# EAGLE design parrot_v2 (EAGLE 9.4.1)
CNAME: Parrot Teensy Board; CREVISION: 1.0; DESIGNER: Nathan Villicana-Shaw
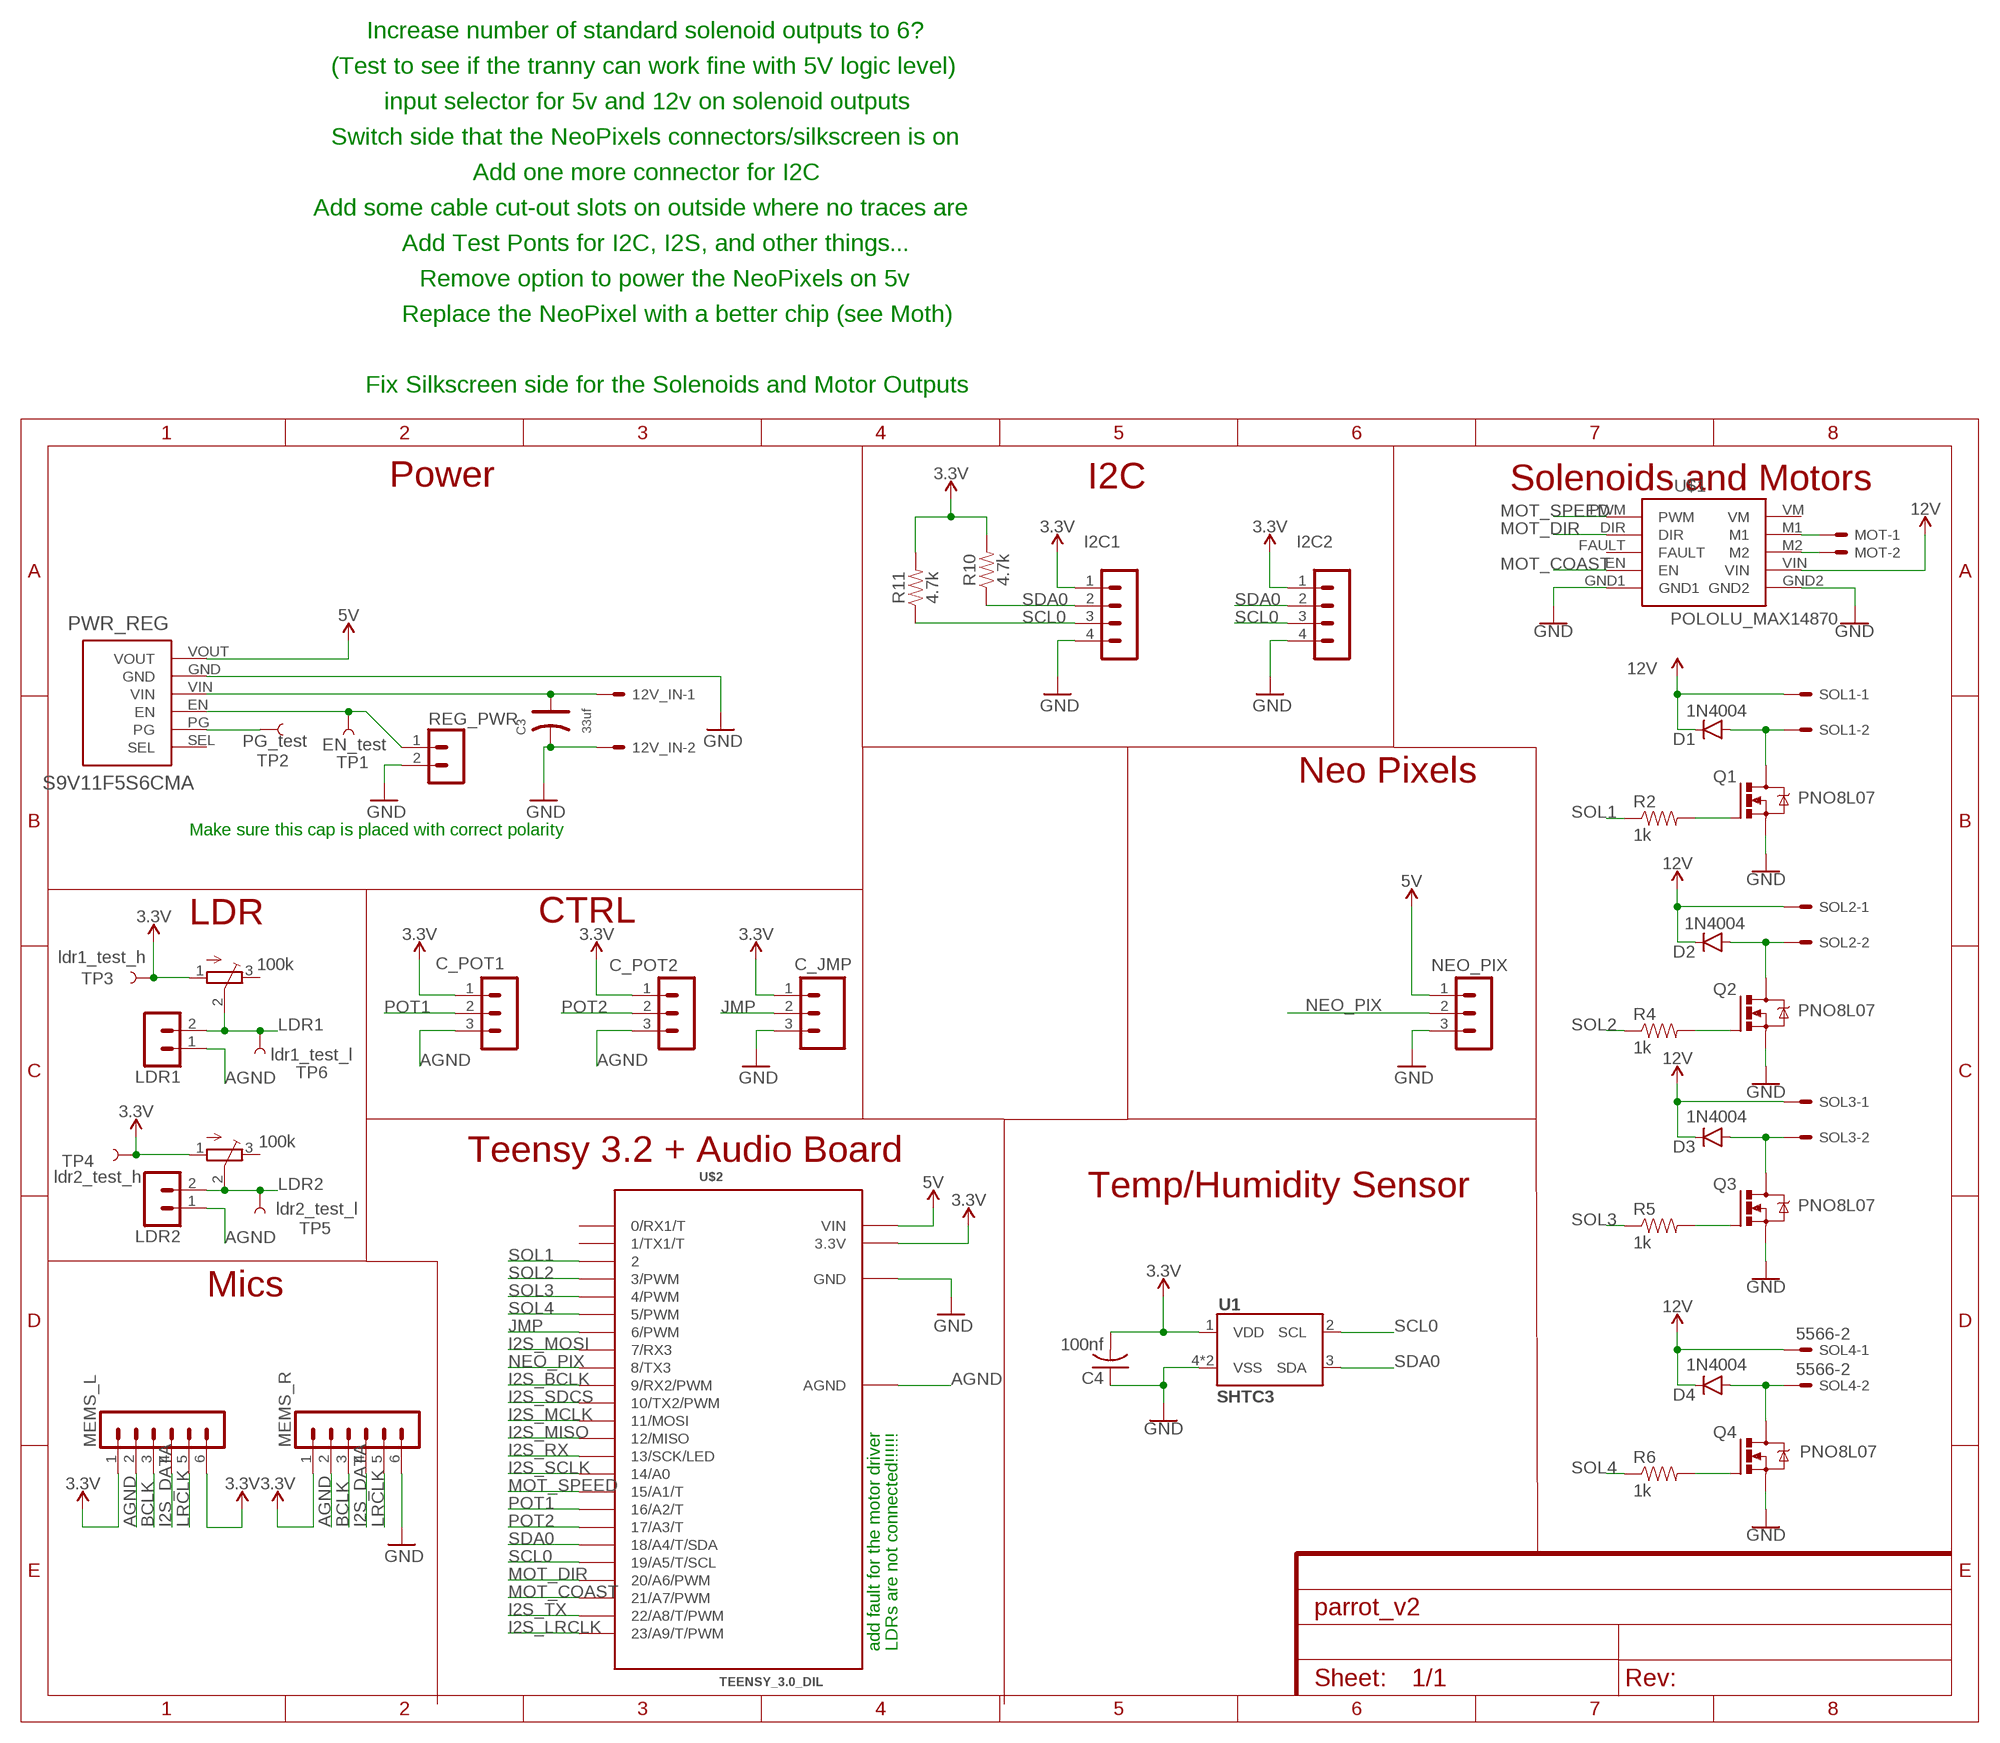
[diagram p0: schematic, sheet 1]

## Parts
12V_IN  5566-2  [5566-2]
C3  33uf  DIP-ALUMINUM-47UF-16V(D5-H7MM)  [PC-D5.3MM]
C4  100nf  C-USC2012  [C2012]
C_JMP  CONN_03  [1X03]
C_POT1  B3B-PH-K  [B3B-PH-K]
C_POT2  B3B-PH-K  [B3B-PH-K]
D1  1N4004  DIODEPTH  [DIODE-1N4001]
D2  1N4004  DIODEPTH  [DIODE-1N4001]
D3  1N4004  DIODEPTH  [DIODE-1N4001]
D4  1N4004  DIODEPTH  [DIODE-1N4001]
I2C1  B4B-PH-K  [B4B-PH-K]
I2C2  B4B-PH-K  [B4B-PH-K]
LDR1  B2B-PH-K  [B2B-PH-K]
LDR2  B2B-PH-K  [B2B-PH-K]
MEMS_L  B6B-PH-K  [B6B-PH-K]
MEMS_R  B6B-PH-K  [B6B-PH-K]
MOT  5566-2  [5566-2]
NEO_PIX  B3B-PH-K  [B3B-PH-K]
PWR_REG  S9V11F5S6CMA  [S9V11F3S5CMA]
Q1  PNO8L07  IRF540  [TO220BV]
Q2  PNO8L07  IRF540  [TO220BV]
Q3  PNO8L07  IRF540  [TO220BV]
Q4  PNO8L07  IRF540  [TO220BV]
R2  1k  10KOHM-HORIZ-1/4W-5%  [AXIAL-0.3]
R4  1k  10KOHM-HORIZ-1/4W-5%  [AXIAL-0.3]
R5  1k  10KOHM-HORIZ-1/4W-5%  [AXIAL-0.3]
R6  1k  10KOHM-HORIZ-1/4W-5%  [AXIAL-0.3]
R10  4.7k  10OHM-HORIZ-1/4W-1%  [AXIAL-0.3]
R11  4.7k  10OHM-HORIZ-1/4W-1%  [AXIAL-0.3]
REG_PWR  B2B-PH-K  [B2B-PH-K]
SOL1  5566-2  [5566-2]
SOL2  5566-2  [5566-2]
SOL3  5566-2  [5566-2]
SOL4  5566-2  [5566-2]
TM1  100k  TRIMPOTTC33X  [TC33X]
TM2  100k  TRIMPOTTC33X  [TC33X]
TP1  EN_test  TEST-POINTTP_15TH_THRU  [TP_15TH]
TP2  PG_test  TEST-POINTTP_15TH_THRU  [TP_15TH]
TP3  ldr1_test_h  TEST-POINTTP_15TH_THRU  [TP_15TH]
TP4  ldr2_test_h  TEST-POINTTP_15TH_THRU  [TP_15TH]
TP5  ldr2_test_l  TEST-POINTTP_15TH_THRU  [TP_15TH]
TP6  ldr1_test_l  TEST-POINTTP_15TH_THRU  [TP_15TH]
U1  SHTC3  [SHTC3]
U$1  POLOLU_MAX14870  [POLOLU_MAX14870]
U$2  TEENSY_3.0_DIL  [TEENSY_3.0-3.2&LC_DIL]

## Nets
3.3V [3.3V]: C4.2 C_JMP.1 C_POT1.1 C_POT2.1 I2C1.1 I2C2.1 MEMS_L.1 MEMS_L.6 MEMS_R.1 R10.P$2 R11.P$2 TM1.1(A) TM2.1(A) TP3.P$1 TP4.P$1 U1.1(VDD) U$2.3.3V
5V: NEO_PIX.1 PWR_REG.VOUT U$2.VIN
12V [12V_IN]: 12V_IN.1 C3.+ D1.C D2.C D3.C D4.C PWR_REG.VIN SOL1.1 SOL2.1 SOL3.1 SOL4.1 U$1.VIN
AGND: C_POT1.3 C_POT2.3 LDR1.1 LDR2.1 MEMS_L.2 MEMS_R.2 U$2.AGND
BCLK: MEMS_L.3 MEMS_R.3
GND: 12V_IN.2 C3.- C4.1 C_JMP.3 I2C1.4 I2C2.4 MEMS_R.6 NEO_PIX.3 PWR_REG.GND Q1.S Q2.S Q3.S Q4.S REG_PWR.2 U1.4(VSS) U1.5(VSS) U$1.GND2 U$2.GND
I2S_BCLK: U$2.9(9/RX2/PWM)
I2S_DATA: MEMS_L.4 MEMS_R.4
I2S_LRCLK: U$2.23/A9(23/A9/T/PWM)
I2S_MCLK: U$2.11(11/MOSI)
I2S_MISO: U$2.12(12/MISO)
I2S_MOSI: U$2.7(7/RX3)
I2S_RX: U$2.13(13/SCK/LED)
I2S_SCLK: U$2.14/A0
I2S_SDCS: U$2.10(10/TX2/PWM)
I2S_TX: U$2.22/A8(22/A8/T/PWM)
JMP: C_JMP.2 U$2.6(6/PWM)
LDR1: LDR1.2 TM1.2(S) TP6.P$1
LDR2: LDR2.2 TM2.2(S) TP5.P$1
LRCLK: MEMS_L.5 MEMS_R.5
MOT_COAST: U$1.EN U$2.21/A7(21/A7/PWM)
MOT_DIR: U$1.DIR U$2.20/A6(20/A6/PWM)
MOT_SPEED: U$1.PWM U$2.15/A1(15/A1/T)
N$3: PWR_REG.PG TP2.P$1
N$5: Q2.G R4.P$2
N$8: D2.A Q2.D SOL2.2
N$10: PWR_REG.EN REG_PWR.1 TP1.P$1
N$11: Q3.G R5.P$2
N$12: D3.A Q3.D SOL3.2
N$13: Q4.G R6.P$2
N$14: D4.A Q4.D SOL4.2
N$15: U$1.GND1 ; supply symbol labelled GND
N$24: Q1.G R2.P$2
N$25: D1.A Q1.D SOL1.2
N$30: MOT.2 U$1.M2
N$31: MOT.1 U$1.M1
NEO_PIX: NEO_PIX.2 U$2.8(8/TX3)
POT1: C_POT1.2 U$2.16/A2(16/A2/T)
POT2: C_POT2.2 U$2.17/A3(17/A3/T)
SCL0: I2C1.3 I2C2.3 R11.P$1 U1.2(SCL) U$2.19/A5(19/A5/T/SCL)
SDA0: I2C1.2 I2C2.2 R10.P$1 U1.3(SDA) U$2.18/A4(18/A4/T/SDA)
SOL1: R2.P$1 U$2.2
SOL2: R4.P$1 U$2.3(3/PWM)
SOL3: R5.P$1 U$2.4(4/PWM)
SOL4: R6.P$1 U$2.5(5/PWM)
Unconnected: PWR_REG.SEL TM1.3(E) TM2.3(E) U$1.FAULT U$1.VM U$2.0(0/RX1/T) U$2.1(1/TX1/T)

## Notes on the sheet
- Increase number of standard solenoid outputs to 6?
- (Test to see if the tranny can work fine with 5V logic level)
- input selector for 5v and 12v on solenoid outputs
- Switch side that the NeoPixels connectors/silkscreen is on
- Add one more connector for I2C
- Add some cable cut-out slots on outside where no traces are
- Add Test Ponts for I2C, I2S, and other things...
- Remove option to power the NeoPixels on 5v
- Replace the NeoPixel with a better chip (see Moth)
- Fix Silkscreen side for the Solenoids and Motor Outputs
- Solenoids and Motors
- Power | I2C
- Neo Pixels
- Make sure this cap is placed with correct polarity
- LDR | CTRL
- Teensy 3.2 + Audio Board
- Temp/Humidity Sensor
- Mics
- add fault for the motor driver | LDRs are not connected!!!!!!

## Library data of the parts
12V_IN MOT SOL1-SOL4 = con-molex:5566-2: Mini FIT connector 2 pol Source: http://www.molex.com; MF: MOLEX; OC_FARNELL: 1822072; OC_NEWARK: unknown
C3 = Seeed-Capacitor:DIP-ALUMINUM-47UF-16V(D5-H7MM): 302030033; MPN: KS 100uF/16V; VALUE: 100uf
C4 = adafruit:C-US: CAPACITOR, American symbol
C_JMP = SparkFun-Connectors:CONN_03: Multi connection point. Often used as Generic Header-pin footprint for 0.1 inch spaced/style header connections On any of the 0.1 inch spaced packages, you can populate with these: Break Away Headers - Straight <https://www.sparkfun.com/products/116> (PRT-00116) Break Away Male Headers - Right Angle <https://www.sparkfun.com/products/553> (PRT-00553) Female Headers <https://www.sparkfun.com/products/115> (PRT-00115) Break Away Headers - Machine Pin <https://www.sparkfun.com/products/117> (PRT-00117) Break Away Female Headers - Swiss Machine Pin <https://www.sparkfun.com/products/743> (PRT-00743) Stackable Header - 3 Pin (Female, 0.1") <https://www.sparkfun.com/products/13875> (PRT-13875) For SCREWTERMINALS and SPRING TERMINALS visit here: Screw Terimnals on SparkFun.com <https://www.sparkfun.com/search/results?term=Screw+Terminals> (5mm/3.5mm/2.54mm spacing) This device is also useful as a general connection point to wire up your design to another part of your project. Our various solder wires solder well into these plated through hole pads. Hook-Up Wire - Assortment (Stranded, 22 AWG) <https://www.sparkfun.com/products/11375> (PRT-11375) Hook-Up Wire - Assortment (Solid Core, 22 AWG) <https://www.sparkfun.com/products/11367> (PRT-11367) View the entire wire category on our website here <https://www.sparkfun.com/categories/141> Special notes: Molex polarized connector foot print use with SKU : PRT-08232 with associated crimp pins and housings.
C_POT1 C_POT2 NEO_PIX = con-jst-ph:B3B-PH-K: HEADER
D1-D4 = SparkFun-DiscreteSemi:DIODE: Diode These are standard reverse protection diodes and small signal diodes. SMA package can handle up to about 1A. SOD-323 can handle about 200mA. What the SOD-323 package when ordering, there are some mfgs out there that are 5-pin packages.
I2C1 I2C2 = con-jst-ph:B4B-PH-K: HEADER
LDR1 LDR2 REG_PWR = con-jst-ph:B2B-PH-K: HEADER
MEMS_L MEMS_R = con-jst-ph:B6B-PH-K: HEADER
PWR_REG = nathans-custom-parts:S9V11F5S6CMA
Q1-Q4 = transistor-power:IRF540: HEXFET Power MOSFET
R2 R4-R6 = SparkFun-Resistors:10KOHM: 10kΩ resistor A resistor is a passive two-terminal electrical component that implements electrical resistance as a circuit element. Resistors act to reduce current flow, and, at the same time, act to lower voltage levels within circuits. - Wikipedia; PROD_ID: RES-09435; VALUE: 10k
R10 R11 = SparkFun-Resistors:10OHM: 10Ω resistor A resistor is a passive two-terminal electrical component that implements electrical resistance as a circuit element. Resistors act to reduce current flow, and, at the same time, act to lower voltage levels within circuits. - Wikipedia; PROD_ID: RES-12180; VALUE: 10
TM1 TM2 = adafruit:TRIMPOT: SMT trimmer potentiometer part number TC33X http://www.ladyada.net/library/eagle
TP1-TP6 = SparkFun-Connectors:TEST-POINT: SparkFun Test Points Bare copper test points for troubleshooting or In-Circuit-Testing. These are used by our Production team for verifying production board runs using pogo-pins on test beds. SparkFun Products: SparkFun LSM9DS1 Breakout <https://www.sparkfun.com/products/13284> SparkFun PSOC <https://www.sparkfun.com/products/13714> SparkFun Load Cell Amplifier <https://www.sparkfun.com/products/13879>
U1 = SHTC3:SHTC3
U$1 = nathans-custom-parts:POLOLU_MAX14870
U$2 = teensy_3_and_LC:TEENSY_3.0_DIL: TEENSY 3.0 in a classic breadboard layout - pins between the two outer rows.

## Net classes
0 default: width 0.152 mm, drill 0.508 mm, clearance 0.203 mm
1 12V_IN: width 1.27 mm, drill 0.762 mm, clearance 0.305 mm
2 3.3V: width 0.203 mm, drill 0.508 mm, clearance 0.254 mm
3 5V: width 0.406 mm, drill 0.508 mm, clearance 0.381 mm

## Board
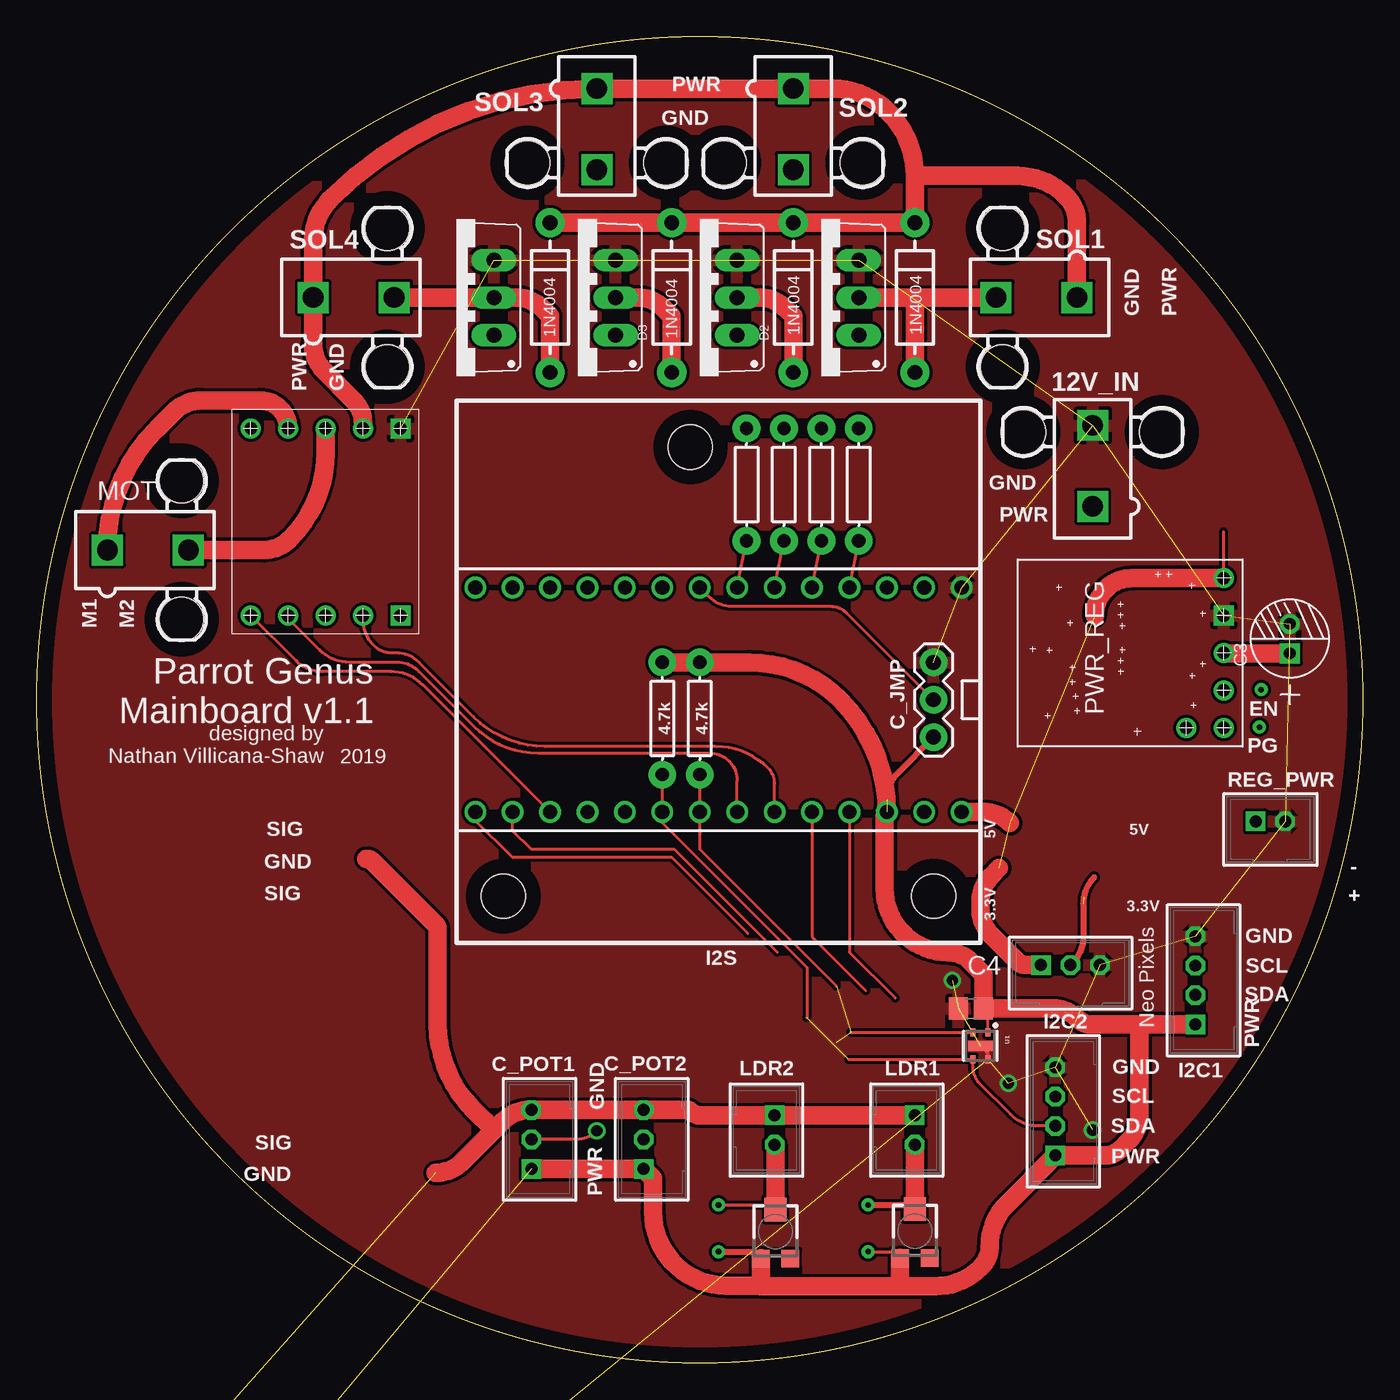
[diagram p1: board, top side]
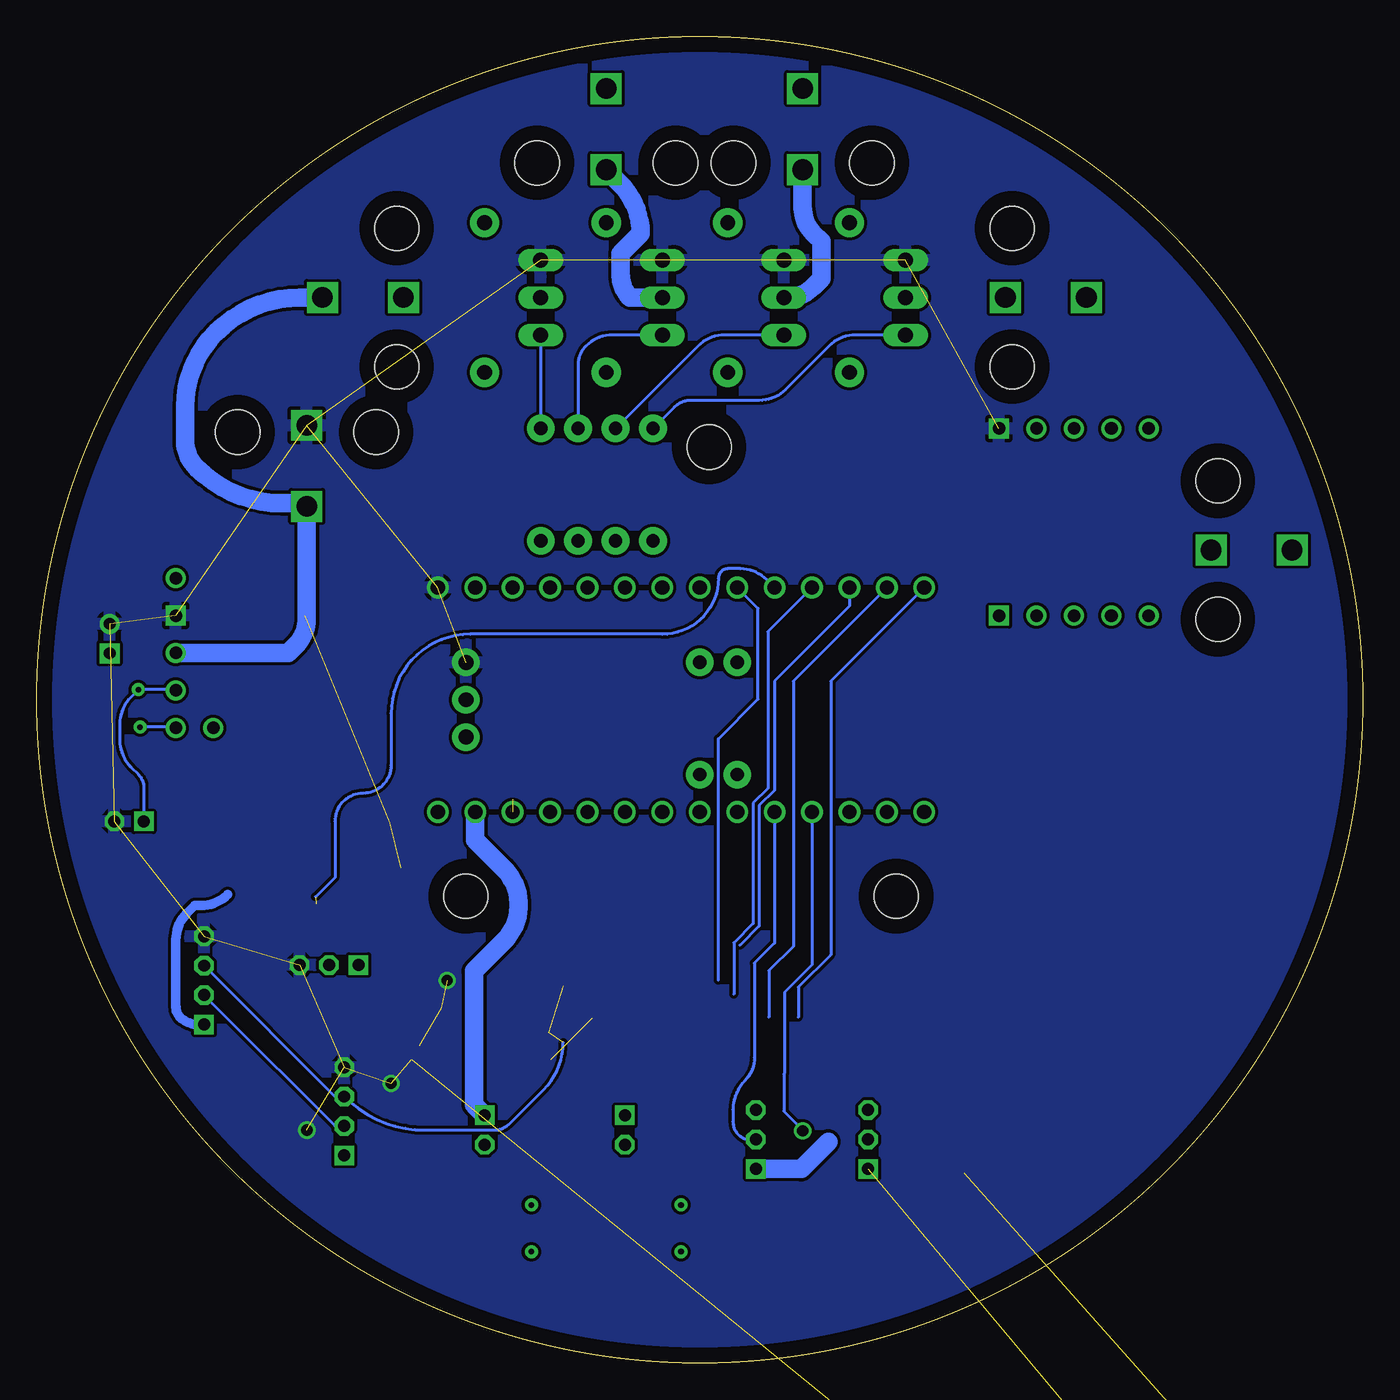
[diagram p2: board, bottom side, seen from below]

Size 90 x 90 mm. Coordinates in mm from the lower left corner, seen from the top.
Outline: circle at 45,45 radius 45
Copper layers (1*16): Top 0.035mm / dielectric 1.5mm / Bottom 0.035mm
Design rules "PCBway": minimum track width 6mil, minimum drill 0.3mm, track to track 0.205mm, track to pad 0.205mm, pad to pad 0.205mm, via to via 0.205mm, smd to smd 8mil, copper to edge 40mil, drill to drill 8mil, minimum pad ring 10mil, minimum via ring 8mil, stop-mask expansion 4mil, vias tented up to drill 25mil, thermal gap 10mil
Holes 3 mm at 44.37,62.15 31.66,31.67 60.88,31.67

### Footprints (pad centres in the part's own frame; a part is rotated, then mirrored left to right if it is on the bottom)
5566-2 = drill 1.4 square: 1 0,-2.75; 2 0,2.75 | hole 3: 4.7,2.29; -4.7,2.29
PC-D5.3MM = drill 0.8 pad 1.35 square: + -1,0 | drill 0.8 pad 1.35: - 1,0
C2012 = smd 1.3 x 1.5: 1 -0.85,0; 2 0.85,0
1X03 = drill 1.016 pad 1.88: 1 0,0; 2 2.54,0; 3 5.08,0
B3B-PH-K = drill 0.813 square: 1 -2,0 | drill 0.813 octagon: 2 0,0; 3 2,0
DIODE-1N4001 = drill 1 pad 1.981: A -5.08,0; C 5.08,0
B4B-PH-K = drill 0.813 square: 1 -3,0 | drill 0.813 octagon: 2 -1,0; 3 1,0; 4 3,0
B2B-PH-K = drill 0.813 square: 1 -1,0 | drill 0.813 octagon: 2 1,0
B6B-PH-K = drill 0.813 square: 1 -5,0 | drill 0.813 octagon: 2 -3,0; 3 -1,0; 4 1,0; 5 3,0; 6 5,0
S9V11F3S5CMA = drill 0.85: EN 3.81,1.27; PG 1.27,1.27; SEL 1.27,3.81; VIN 6.35,1.27; VOUT 11.43,1.27 | drill 0.85 square: GND 8.89,1.27
TO220BV = drill 1.016 long: D 0,-2.54; G -2.54,-2.54; S 2.54,-2.54
AXIAL-0.3 = drill 0.9 pad 1.88: P$1 -3.81,0; P$2 3.81,0
TC33X = smd 1.2 x 1.2: 1 -1,-1.825; 3 1,-1.825 | smd 1.5 x 1.6: 2 0,1.5
TP_15TH = drill 0.381 pad 0.61: P$1 0,0
SHTC3 = smd 0.55 x 0.35: 1 -0.925,0.5; 2 -0.925,-0.5; 3 0.925,-0.5; 4 0.925,0.5 | smd 0.7 x 1.6: 5 0,0
POLOLU_MAX14870 = drill 0.85: DIR 1.27,8.89; EN 1.27,3.81; FAULT 1.27,6.35; M1 13.97,8.89; M2 13.97,6.35; PWM 1.27,11.43; VIN 13.97,3.81; VM 13.97,11.43 | drill 0.85 square: GND1 1.27,1.27; GND2 13.97,1.27
TEENSY_3.0-3.2&LC_DIL = drill 0.965: 0 -7.62,13.97; 1 -7.62,11.43; 2 -7.62,8.89; 3 -7.62,6.35; 3.3V 7.62,11.43; 4 -7.62,3.81; 5 -7.62,1.27; 6 -7.62,-1.27; 7 -7.62,-3.81; 8 -7.62,-6.35; 9 -7.62,-8.89; 10 -7.62,-11.43; 11 -7.62,-13.97; 12 -7.62,-16.51; 13 7.62,-16.51; 14/A0 7.62,-13.97; 15/A1 7.62,-11.43; 16/A2 7.62,-8.89; 17/A3 7.62,-6.35; 18/A4 7.62,-3.81; 19/A5 7.62,-1.27; 20/A6 7.62,1.27; 21/A7 7.62,3.81; 22/A8 7.62,6.35; 23/A9 7.62,8.89; AGND 7.62,13.97; GND -7.62,16.51; VIN 7.62,16.51

### Placement (x,y rotation side)
12V_IN  71.67,60.88 0 top
C3  85.06,49.15 90 top
C4  63.42,24.05 0 top
C_JMP  60.88,42.46 90 top
C_POT1  33.57,15.16 90 top
C_POT2  41.19,15.16 90 top
D1  59.61,72.31 90 top
D2  51.35,72.31 90 top
D3  43.09,72.31 90 top
D4  34.84,72.31 90 top
I2C1  78.66,25.95 90 top
I2C2  69.13,17.06 90 top
LDR1  59.61,15.79 270 top
LDR2  50.08,15.79 270 top
MEMS_L  -0.09,-21.04 0 top  (outside the outline)
MEMS_R  -0.09,-28.02 0 top  (outside the outline)
MOT  7.54,55.16 270 top
NEO_PIX  70.17,27 0 top
PWR_REG  81.83,41.83 90 top
Q1  53.26,72.31 90 top
Q2  45,72.31 90 top
Q3  36.75,72.31 90 top
Q4  28.49,72.31 90 top
R2  55.8,59.61 90 top
R4  53.26,59.61 90 top
R5  50.72,59.61 90 top
R6  48.18,59.61 90 top
R10  42.46,43.73 90 top
R11  45,43.73 90 top
REG_PWR  83.73,36.75 0 top
SOL1  67.86,72.31 90 top
SOL2  51.35,83.73 180 top
SOL3  38.02,83.73 180 top
SOL4  21.51,72.31 270 top
TM1  59.61,8.93 0 top
TM2  50.14,8.9 0 top
TP1  83.11,45.68 0 top
TP2  82.99,43.14 0 top
TP3  46.27,7.54 0 top
TP4  56.43,7.54 0 top
TP5  46.27,10.71 0 top
TP6  56.43,10.71 0 top
U1  64.05,21.51 270 top
U$1  25.95,49.45 90 top
U$2  46.27,45 270 top

### Tracks (layer width: path | path; a pad name or v marks a point on that pad's centre or on a via)
3.3V  (4 unrouted)
  Top 0.203: U1.1 64.55,23.76 | TP4.P$1 58.18,7.54 arc-90 TM1.1
  Top 0.406: 64.55,23.76 C4.2 | TP3.P$1 48.68,7.54 TM2.1 | C_JMP.1 58.44,40.03 arc45 57.7,38.23
  Top 1.27: R11.P$2 R10.P$2 48.35,47.54 arc-45 54.56,44.97 arc-45 U$2.3.3V arc45 57.54,36.99 57.54,32.2 arc90 61.88,27.86 arc-45 63.42,27.22 64.27,26.37 C4.2 68.98,24.05 arc-45 70.6,23.38 arc45 71.63,22.95 74.84,22.95 | I2C1.1 74.84,22.95 | 74.84,22.95 74.84,16.84 arc-45 74.1,15.05 73.58,14.52 arc-45 72.46,14.06 I2C2.1 65.87,10.8 arc45 64.69,7.94 arc-45 64.08,6.48 arc-45 60.96,5.19 58.97,5.19 | C_POT1.1 C_POT2.1 41.83,12.52 41.83,10.23 arc90 46.82,5.23 49.27,5.23 arc-45 49.16,5.19 | 49.16,5.19 58.97,5.19 | TM2.1 49.14,5.19 49.16,5.19 | 58.61,5.55 58.97,5.19 | TM1.1 58.61,5.55 | 58.61,5.55 arc90 58.97,5.19
  Bottom 0.635: 77.06,31.77 arc45 78.85,31.03 79.29,31.03 79.82,30.5 arc-45 80.56,28.71 80.56,24.17 arc-45 80.26,23.45 arc-45 79.06,22.95 I2C1.1
  Bottom 1.27: C_POT2.1 38.11,13.16 36.27,15
5V  (2 unrouted)
  Top 0.203: PWR_REG.VOUT 80.56,56.4
  Top 1.27: 71.81,50.72 arc-90 74.34,53.26 PWR_REG.VOUT | U$2.VIN 64.27,37.38 arc-45 66.06,36.64 | 65.32,33.57 64.79,33.04 arc45 64.05,31.25 64.05,30.81 arc45 64.79,29.02 66.59,27.22 arc45 67.13,27 NEO_PIX.1
12V
  Top 1.27: D3.C D1.C 59.61,80.56 | 59.61,80.56 arc45 57.81,84.9 arc45 53.97,86.48 SOL2.1 SOL3.1 arc45 19.95,79 arc45 18.76,76.13 SOL4.1 18.76,69.12 arc45 19.5,67.33 21.51,65.32 arc-45 22.14,63.79 U$1.VIN | SOL1.1 70.61,77.39 arc45 69.87,79.19 arc45 66.56,80.56 59.61,80.56 | PWR_REG.VIN arc-45 80.62,48.15 C3.+ | D3.C D4.C | D2.C D3.C
  Bottom 1.27: PWR_REG.VIN 72.94,48.18 72.41,48.7 arc-45 71.67,50.5 12V_IN.1 arc-45 72.18,58.34 73.31,58.34 arc45 79.18,60.77 arc45 79.93,62.56 79.93,64.93 arc45 77.86,69.93 arc45 72.12,72.31 SOL1.1
AGND  (2 unrouted)
  Top 1.27: 27.07,12.89 arc45 28.87,13.63 31.03,15.79 | 31.03,15.79 31.65,16.41 arc-45 33.45,17.16 C_POT1.3 C_POT2.3 44.14,17.16 arc-45 44.37,17.06 arc45 45.02,16.79 LDR2.1 LDR1.1 | 22.36,34.21 arc-45 22.8,34.02 27.14,29.68 arc-23 27.22,29.28 27.22,22.93 arc45 29.57,17.25 31.03,15.79
  Bottom 1.27: LDR1.1 60.33,17.51 60.33,26.58 58.31,28.6 arc-90 58.31,33.56 60.24,35.49 U$2.AGND
BCLK  (1 unrouted)
GND  (via drill 0.76)  (19 unrouted)
  Top 0.203: U1.4 64.55,20.87 | 64.55,20.87 64.55,21.18 arc-45 64.69,21.51 | U1.5 64.45,21.1 arc-45 64.55,20.87
  other vias: 62.15,25.95 65.95,18.97 71.67,15.79
  pour Top: -7.07,89.45 -7.07,-1.35 102.78,-1.35 102.78,89.45
  pour Bottom: -7.07,90.72 104.69,90.72 104.69,-2.62 -7.07,-2.62
I2S_BCLK
  Bottom 0.203: U$2.9 40.37,49.63 40.37,38.98 41.37,37.98 41.37,29.81 42.68,28.5 42.68,25
I2S_DATA  (1 unrouted)
I2S_LRCLK
  Top 0.203: U$2.23/A9 55.16,27.86 58.27,24.75
I2S_MCLK
  Bottom 0.203: U$2.11 38.65,46.27 38.65,28.27 40.3,26.62 40.3,23.44
I2S_MISO
  Bottom 0.203: U$2.12 36.11,46.27 36.11,27.7 38.3,25.51 38.3,23.44
I2S_MOSI
  Bottom 0.203: U$2.7 41.04,51.2 41.04,45.05 43.73,42.35 43.73,25.95
I2S_RX
  Top 0.203: 48.27,29.13 43.11,34.28 32.3,34.28 29.76,36.82 U$2.13
I2S_SCLK
  Top 0.203: 50.27,27.86 43.29,34.84 33.57,34.84 32.3,36.11 U$2.14/A0
I2S_SDCS
  Bottom 0.203: U$2.10 34.84,51.35 39.92,46.27 39.92,38.86 40.96,37.81 40.96,29.64 42.27,28.33
I2S_TX
  Top 0.203: U$2.22/A8 52.62,28.9 56.27,25.25
JMP
  Top 0.203: U$2.6 45.63,51.98 arc45 47.17,51.35 53.89,51.35 arc-45 54.97,50.9 C_JMP.2
LDR1
  Top 0.406: TP6.P$1 59.33,10.71 TM1.2
  Top 1.27: LDR1.2 TM1.2
LDR2
  Top 0.203: TP5.P$1 49.83,10.71 TM2.2
  Top 1.27: LDR2.2 arc-45 50.14,14.64 TM2.2
LRCLK  (1 unrouted)
MOT_COAST
  Top 0.203: U$2.21/A7 50.08,39.29 arc45 49.63,40.37 arc45 46.12,41.83 34.51,41.83 arc-45 29.65,43.84 25.95,47.54 arc45 24.42,48.18 24.05,48.18 arc-45 22.96,48.62 22.78,48.81 arc-45 22.14,50.34 U$1.EN
MOT_DIR
  Top 0.203: U$2.20/A6 47.54,39.5 arc90 45.66,41.38 34.05,41.38 arc-45 29.65,43.2 25.94,46.92 arc45 24.43,47.54 21.23,47.54 arc-45 19.21,48.38 17.06,50.52 U$1.DIR
MOT_SPEED
  Top 0.203: U$2.15/A1 26.21,46.01 arc45 24.04,46.91 19.38,46.91 arc-45 17.59,47.65 U$1.PWM
N$3
  Bottom 0.203: PWR_REG.PG arc-45 80.68,43.15 TP2.P$1
N$5
  Bottom 0.203: Q2.G 50.93,69.77 arc-45 52.73,69.02 arc-45 53.26,67.75 R4.P$2
N$8
  Top 1.27: Q2.D 49.03,72.31 arc-45 50.82,71.56 51.35,71.04 D2.A
  Bottom 1.27: SOL2.2 50.43,80.06 arc45 49.01,76.64 50.37,75.29 50.37,73.84 arc-45 49.73,72.31 Q2.D
N$10
  Bottom 0.203: PWR_REG.EN arc-45 80.68,45.69 TP1.P$1 83.63,45.17 arc-45 84.37,43.37 84.37,42.24 arc-45 83.63,40.45 83.1,39.92 arc45 82.73,39.04 REG_PWR.1
N$11
  Bottom 0.203: Q3.G 43.31,69.77 arc-45 45.11,69.02 R5.P$2
N$12
  Top 1.27: Q3.D 40.77,72.31 arc-45 42.57,71.56 43.09,71.04 D3.A
  Bottom 1.27: SOL3.2 38.02,78.44 arc-45 37.27,76.64 36.75,76.12 36.75,73.58 37.27,73.05 arc45 39.07,72.31 Q3.D
N$13
  Bottom 0.203: Q4.G 34.42,69.77 arc-45 36.22,69.02 39.18,66.06 arc45 40.97,65.32 45.63,65.32 arc-45 46.72,64.87 R6.P$2
N$14
  Top 1.27: SOL4.2 Q4.D 32.52,72.31 arc-45 34.31,71.56 34.84,71.04 D4.A
N$24
  Bottom 0.203: Q1.G R2.P$2
N$25
  Top 1.27: Q1.D 59.61,72.31 | 59.61,72.31 SOL1.2 | D1.A 59.61,72.31
N$30
  Top 1.27: U$1.M2 19.6,61.77 arc-45 17.17,55.9 arc-45 15.37,55.16 MOT.2
N$31
  Top 1.27: MOT.1 4.79,55.29 arc-45 8.14,63.38 9.33,64.58 arc-45 11.13,65.32 15.16,65.32 arc-90 U$1.M1
NEO_PIX  (1 unrouted)
  Top 0.406: 71.78,32.94 arc45 71.03,31.15 71.03,28.91 arc-45 70.29,27.12 NEO_PIX.2
  Bottom 0.203: U$2.8 40.45,53.15 arc-45 42.24,53.89 43.09,53.89 arc-90 43.73,53.26 arc90 47.54,49.45 60.58,49.45 arc-90 65.95,44.07 65.95,40.56 arc90 67.86,38.65 arc-90 69.77,36.75 69.77,32.94 71.08,31.62
POT1  (via drill 0.76)
  Top 0.203: v38.02,15.73 arc-45 36.62,15.16 C_POT1.2
  Bottom 0.203: v38.02,15.73 38.02,15.79 39.29,17.06 39.29,19.6 39.24,19.65 39.24,25.15 37.38,27 U$2.16/A2
POT2
  Bottom 0.203: U$2.17/A3 39.92,28.49 41.29,27.13 41.29,20.72 arc45 41.94,19.13 arc-45 42.75,17.2 42.75,16.36 arc-90 41.48,15.09 41.25,15.09 C_POT2.2
SCL0  (2 unrouted)
  Top 0.203: R11.P$1 U$2.19/A5 45,34.84 54.27,25.57 | 55.25,22.43 U1.2
  Bottom 0.203: I2C1.3 69.77,18.06 I2C2.3 arc-45 63.65,15.79 58.97,15.79 arc-45 57.89,16.24 55.6,18.53 arc-45 54.27,21.74
SDA0  (1 unrouted)
  Top 0.203: R10.P$1 U$2.18/A4 42.46,36.65 52.27,26.84 52.27,23.41 | 55.1,20.58 U1.3 63.55,20.05 arc45 64.01,18.94 66.11,16.85 arc45 68,16.06 I2C2.2
  Bottom 0.203: I2C2.2 69.77,16.06 77.51,23.81 77.8,24.09 I2C1.2
SOL1
  Top 0.203: U$2.2 R2.P$1
SOL2
  Top 0.203: U$2.3 R4.P$1
SOL3
  Top 0.203: U$2.4 R5.P$1
SOL4
  Top 0.203: U$2.5 R6.P$1

### Text on the board
tNames: PWR | GND | GND | PWR | PWR | GND | GND | PWR | M1 | M2 | Parrot Genus / Mainboard v1.1 | designed by / Nathan Villicana-Shaw | EN | 2019 | PG | SIG | 5V | 5V | GND | - | SIG | + | 3.3V | 3.3V | Neo Pixels | GND | I2S | SCL | SDA | PWR | GND | GND | SCL | SIG | SDA | GND | PWR | PWR
tValues: PWR | GND | PWR | GND | VIN | VM | M1 | M2 | GND | PWR | GND | SPEED | DIR | FAULT | COAST | GND | VOUT | GND | VIN | EN | PG | SEL | 3.3V | 3.3V | 3.3V | 3.3V